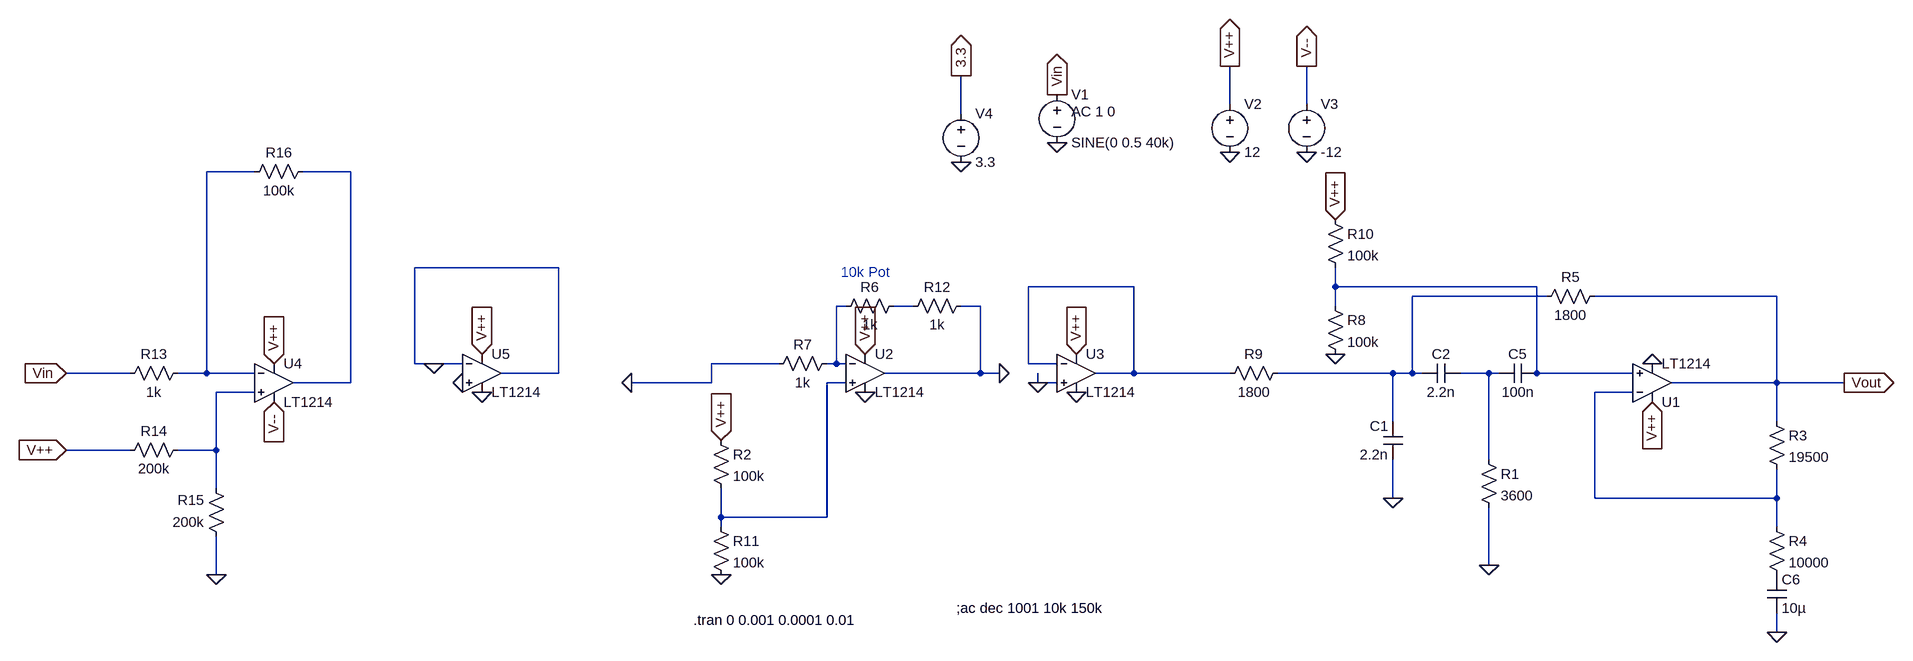
[diagram p0: schematic TxNew1.asc]
TxNew1.asc, the LTspice schematic file:
Version 4
SHEET 1 1120 680
WIRE -16 -320 -16 -384
WIRE 112 -320 112 -384
WIRE -464 -304 -464 -368
WIRE -1920 -208 -2000 -208
WIRE -1760 -208 -1840 -208
WIRE -1360 -48 -1600 -48
WIRE -176 -16 -352 -16
WIRE 160 -16 160 -48
WIRE 496 -16 160 -16
WIRE 512 0 288 0
WIRE 896 0 592 0
WIRE -656 16 -672 16
WIRE -544 16 -576 16
WIRE -432 16 -464 16
WIRE 160 16 160 -16
WIRE -1600 112 -1600 -48
WIRE -1568 112 -1600 112
WIRE -1520 112 -1568 112
WIRE -768 112 -880 112
WIRE -672 112 -672 16
WIRE -672 112 -688 112
WIRE -656 112 -672 112
WIRE -352 112 -352 -16
WIRE -304 112 -352 112
WIRE -2128 128 -2288 128
WIRE -2000 128 -2000 -208
WIRE -2000 128 -2048 128
WIRE -1920 128 -2000 128
WIRE -1360 128 -1360 -48
WIRE -1360 128 -1456 128
WIRE -432 128 -432 16
WIRE -432 128 -592 128
WIRE -400 128 -432 128
WIRE -176 128 -176 -16
WIRE -176 128 -240 128
WIRE -16 128 -176 128
WIRE 256 128 64 128
WIRE 288 128 288 0
WIRE 288 128 256 128
WIRE 304 128 288 128
WIRE 416 128 368 128
WIRE 432 128 416 128
WIRE 496 128 496 -16
WIRE 656 128 496 128
WIRE -1760 144 -1760 -208
WIRE -1760 144 -1856 144
WIRE -880 144 -880 112
WIRE -880 144 -1120 144
WIRE -656 144 -688 144
WIRE -336 144 -336 128
WIRE -304 144 -336 144
WIRE 896 144 896 0
WIRE 896 144 720 144
WIRE 1008 144 896 144
WIRE -1920 160 -1984 160
WIRE 656 160 592 160
WIRE 256 208 256 128
WIRE 896 208 896 144
WIRE -2128 256 -2288 256
WIRE -1984 256 -1984 160
WIRE -1984 256 -2048 256
WIRE 416 272 416 128
WIRE -1984 320 -1984 256
WIRE 256 336 256 272
WIRE 592 336 592 160
WIRE 896 336 896 288
WIRE 896 336 592 336
WIRE -864 368 -864 320
WIRE -688 368 -688 144
WIRE -688 368 -864 368
WIRE -864 384 -864 368
WIRE 896 384 896 336
WIRE 416 448 416 352
WIRE -1984 464 -1984 400
WIRE 896 560 896 528
FLAG 256 336 0
FLAG -16 -240 0
FLAG 112 -240 0
FLAG 1008 144 Vout
IOPIN 1008 144 Out
FLAG -16 -384 V++
IOPIN -16 -384 Out
FLAG 112 -384 V--
IOPIN 112 -384 Out
FLAG -304 -256 0
FLAG -304 -336 Vin
IOPIN -304 -336 Out
FLAG -624 96 V++
IOPIN -624 96 In
FLAG 416 448 0
FLAG -272 96 V++
IOPIN -272 96 In
FLAG -864 464 0
FLAG -624 160 0
FLAG -272 160 0
FLAG -464 -224 0
FLAG -464 -368 3.3
IOPIN -464 -368 Out
FLAG -864 240 V++
IOPIN -864 240 In
FLAG 688 176 V++
IOPIN 688 176 In
FLAG 896 560 0
FLAG 160 96 0
FLAG 160 -128 V++
IOPIN 160 -128 In
FLAG 688 112 0
FLAG -1984 464 0
FLAG -1888 112 V++
IOPIN -1888 112 In
FLAG -2288 256 V++
IOPIN -2288 256 In
FLAG -2288 128 Vin
IOPIN -2288 128 In
FLAG -1488 96 V++
IOPIN -1488 96 In
FLAG -1488 160 0
FLAG -1120 144 0
FLAG -400 128 0
FLAG -336 144 0
FLAG -1888 176 V--
IOPIN -1888 176 In
FLAG -1568 112 0
FLAG -1520 144 0
SYMBOL cap 272 272 R180
WINDOW 0 24 56 Left 2
WINDOW 3 24 8 Left 2
SYMATTR InstName C1
SYMATTR Value 2.2n
SYMBOL cap 368 112 R90
WINDOW 0 0 32 VBottom 2
WINDOW 3 32 32 VTop 2
SYMATTR InstName C2
SYMATTR Value 2.2n
SYMBOL voltage -16 -336 R0
WINDOW 123 0 0 Left 0
WINDOW 39 0 0 Left 0
SYMATTR InstName V2
SYMATTR Value 12
SYMBOL voltage 112 -336 R0
WINDOW 123 0 0 Left 0
WINDOW 39 0 0 Left 0
SYMATTR InstName V3
SYMATTR Value -12
SYMBOL res 880 192 R0
SYMATTR InstName R3
SYMATTR Value 19500
SYMBOL res 880 368 R0
SYMATTR InstName R4
SYMATTR Value 10000
SYMBOL res 608 -16 R90
WINDOW 0 0 56 VBottom 2
WINDOW 3 32 56 VTop 2
SYMATTR InstName R5
SYMATTR Value 1800
SYMBOL voltage -304 -352 R0
WINDOW 123 24 44 Left 2
WINDOW 39 0 0 Left 0
SYMATTR Value2 AC 1 0
SYMATTR InstName V1
SYMATTR Value SINE(0 0.5 40k)
SYMBOL OpAmps\\LT1214 688 208 M180
SYMATTR InstName U1
SYMBOL Opamps\\LT1214 -624 64 R0
SYMATTR InstName U2
SYMBOL res -560 0 R90
WINDOW 0 0 56 VBottom 2
WINDOW 3 32 56 VTop 2
SYMATTR InstName R6
SYMATTR Value 1k
SYMBOL res -672 96 R90
WINDOW 0 0 56 VBottom 2
WINDOW 3 32 56 VTop 2
SYMATTR InstName R7
SYMATTR Value 1k
SYMBOL res 80 112 R90
WINDOW 0 0 56 VBottom 2
WINDOW 3 32 56 VTop 2
SYMATTR InstName R9
SYMATTR Value 1800
SYMBOL Opamps\\LT1214 -272 64 R0
SYMATTR InstName U3
SYMBOL res -880 368 R0
SYMATTR InstName R11
SYMATTR Value 100k
SYMBOL res -448 0 R90
WINDOW 0 0 56 VBottom 2
WINDOW 3 32 56 VTop 2
SYMATTR InstName R12
SYMATTR Value 1k
SYMBOL res 400 256 R0
SYMATTR InstName R1
SYMATTR Value 3600
SYMBOL res -880 224 R0
SYMATTR InstName R2
SYMATTR Value 100k
SYMBOL voltage -464 -320 R0
WINDOW 123 0 0 Left 0
WINDOW 39 0 0 Left 0
SYMATTR InstName V4
SYMATTR Value 3.3
SYMBOL res 144 0 R0
SYMATTR InstName R8
SYMATTR Value 100k
SYMBOL res 144 -144 R0
SYMATTR InstName R10
SYMATTR Value 100k
SYMBOL cap 496 112 R90
WINDOW 0 0 32 VBottom 2
WINDOW 3 32 32 VTop 2
SYMATTR InstName C5
SYMATTR Value 100n
SYMBOL cap 880 464 R0
SYMATTR InstName C6
SYMATTR Value 10µ
SYMBOL res -2032 112 R90
WINDOW 0 0 56 VBottom 2
WINDOW 3 32 56 VTop 2
SYMATTR InstName R13
SYMATTR Value 1k
SYMBOL res -2032 240 R90
WINDOW 0 0 56 VBottom 2
WINDOW 3 32 56 VTop 2
SYMATTR InstName R14
SYMATTR Value 200k
SYMBOL res -1968 416 R180
WINDOW 0 36 76 Left 2
WINDOW 3 36 40 Left 2
SYMATTR InstName R15
SYMATTR Value 200k
SYMBOL res -1824 -224 R90
WINDOW 0 0 56 VBottom 2
WINDOW 3 32 56 VTop 2
SYMATTR InstName R16
SYMATTR Value 100k
SYMBOL Opamps\\LT1214 -1888 80 R0
SYMATTR InstName U4
SYMBOL Opamps\\LT1214 -1488 64 R0
SYMATTR InstName U5
TEXT -472 520 Left 2 !;ac dec 1001 10k 150k
TEXT -664 -40 Left 2 ;10k Pot
TEXT -910 540 Left 2 !.tran 0 0.001 0.0001 0.01

The netlist it stands for:
* TxNew1.asc
C1 0 N005 2.2n
C2 N008 N005 2.2n
V2 V++ 0 12
V3 V-- 0 -12
R3 Vout N011 19500
R4 N011 P001 10000
R5 Vout N005 1800
V1 Vin 0 SINE(0 0.5 40k) AC 1 0
XU1 N004 N011 V++ 0 Vout LT1213  ; LT1214, pins In+ In- V+ V- OUT
XU2 N009 N006 V++ 0 0 LT1213  ; LT1214, pins In+ In- V+ V- OUT
R6 N007 N006 1k
R7 N006 0 1k
R9 N005 N003 1800
XU3 0 N003 V++ 0 N003 LT1213  ; LT1214, pins In+ In- V+ V- OUT
R11 N009 0 100k
R12 0 N007 1k
R1 N008 0 3600
R2 V++ N009 100k
V4 3.3 0 3.3
R8 N004 0 100k
R10 V++ N004 100k
C5 N004 N008 100n
C6 P001 0 10µ
R13 N001 Vin 1k
R14 N010 V++ 200k
R15 0 N010 200k
R16 N002 N001 100k
XU4 N010 N001 V++ V-- N002 LT1213  ; LT1214, pins In+ In- V+ V- OUT
XU5 0 0 V++ 0 0 LT1213  ; LT1214, pins In+ In- V+ V- OUT
;ac dec 1001 10k 150k
* 10k Pot
.tran 0 0.001 0.0001 0.01
.lib LTC.lib
.backanno
.end